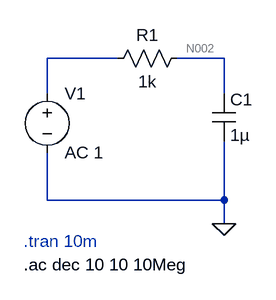
[diagram p0: schematic A.asc]
A.asc, the LTspice schematic file:
Version 4
SHEET 1 880 680
WIRE 112 128 16 128
WIRE 256 128 192 128
WIRE 16 176 16 128
WIRE 256 176 256 128
WIRE 16 320 16 256
WIRE 256 320 256 240
WIRE 256 320 16 320
WIRE 256 352 256 320
FLAG 256 352 0
SYMBOL res 208 112 R90
WINDOW 0 0 56 VBottom 2
WINDOW 3 32 56 VTop 2
SYMATTR InstName R1
SYMATTR Value 1k
SYMBOL cap 240 176 R0
SYMATTR InstName C1
SYMATTR Value 1µ
SYMBOL voltage 16 160 R0
WINDOW 123 0 0 Left 0
WINDOW 39 0 0 Left 0
SYMATTR InstName V1
SYMATTR Value AC 1
TEXT -16 376 Left 2 ;.tran 10m
TEXT -16 408 Left 2 !.ac dec 10 10 10Meg

The netlist it stands for:
* A.asc
R1 N002 N001 1k
C1 N002 0 1µ
V1 N001 0 AC 1
* .tran 10m
.ac dec 10 10 10Meg
.backanno
.end

* Results of the author's LTspice run, read from the files saved beside the schematic
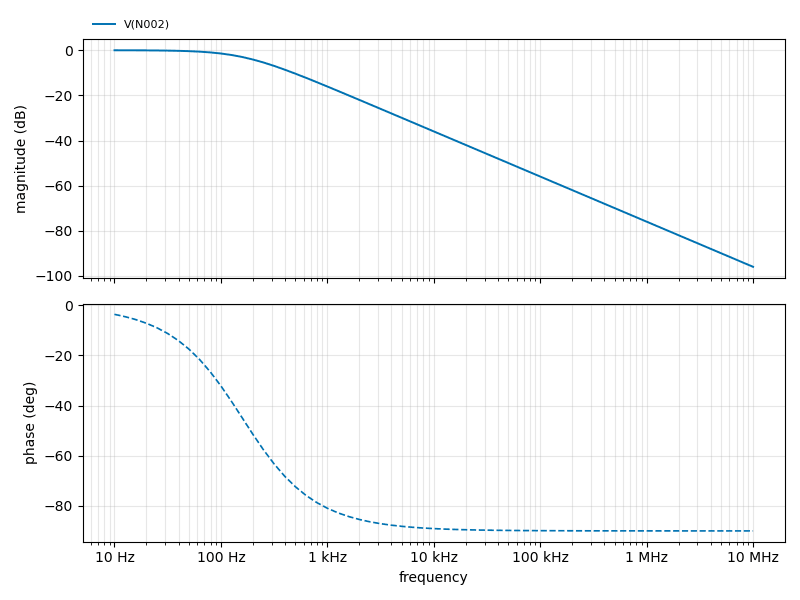
[diagram p1: AC Analysis of A.asc, plotted from the saved traces]
* AC Analysis, 1 run:
*   V(N002): -0.02 dB at 10 Hz, -95.96 dB at 10 MHz, peak -0.02 dB at 10 Hz, 3 dB below the peak at 159.7 Hz